# Altium schematic sheet IonValveCtrl.SchDoc
size A
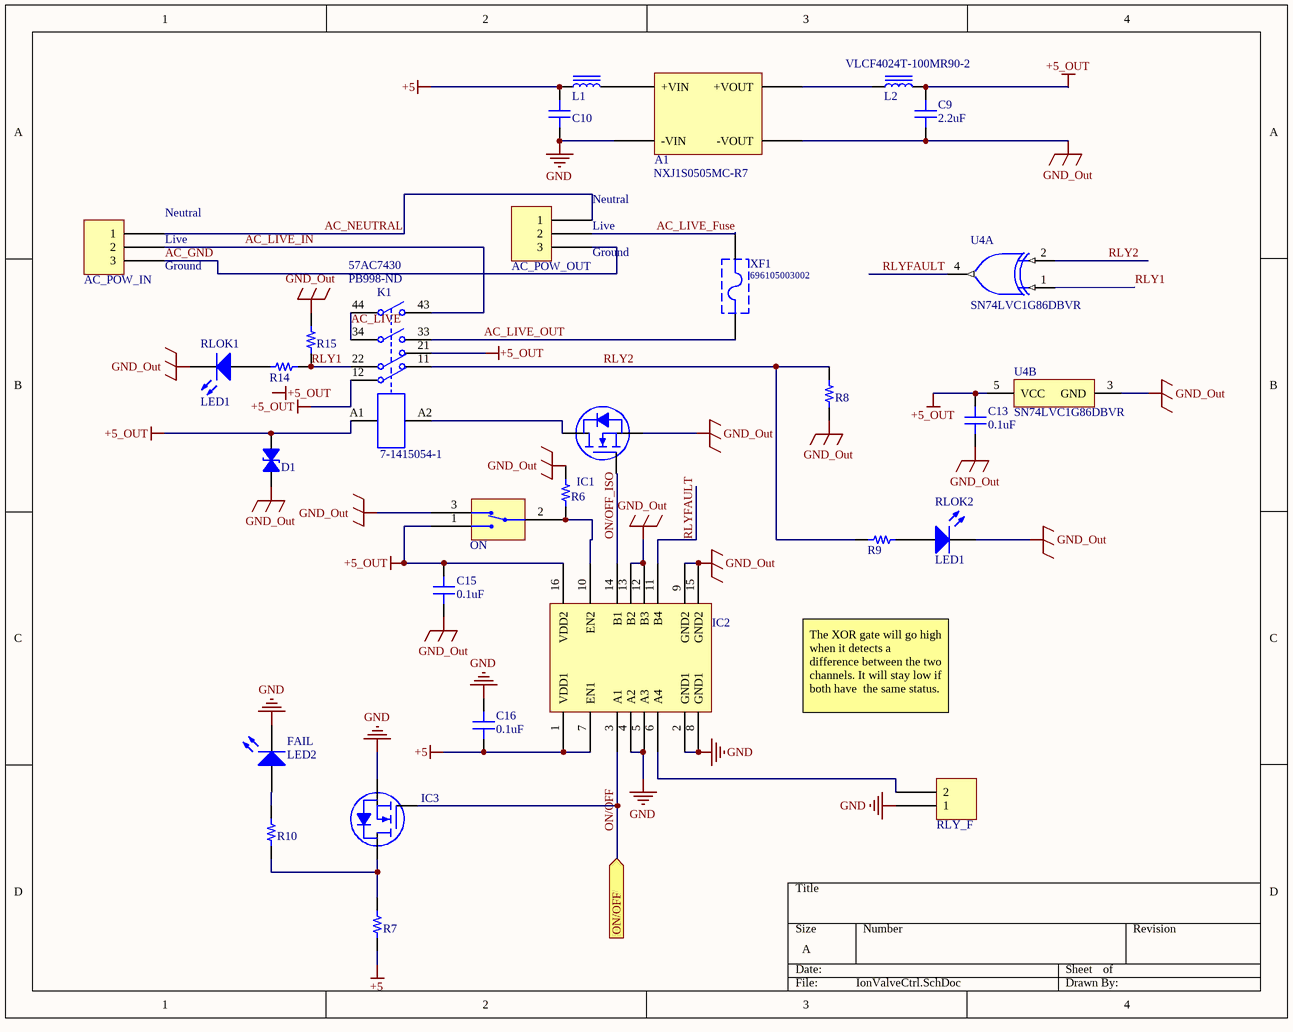
[diagram p0: IonValveCtrl.SchDoc]

## Parts
A1  NXJ1S0505MC-R7  [MURATA NXJ1]
AC_POW_IN  691508110303  [WURTH 691508110303]  (value not drawn)
AC_POW_OUT  691508110303  [WURTH 691508110303]  (value not drawn)
C9  2.2uF  [CAP 1206/3216]
C10  4.7uF  [CAP 1206/3216 - 1.8MM]  (value not drawn)
C13  0.1uF  [CAP 0805/2012]
C15  0.1uF  [CAP 0805/2012]
C16  0.1uF  [CAP 0805/2012]
D1  SM15T15CA  [ST DO214AB SMC]  (value not drawn)
FAIL  LED2  [LED-1]
IC1  BSS138WH6327XTSA1  [INFINEON SOT-323-3]  (value not drawn)
IC2  SI8641BB-B-IS  [SI LABS SOIC-16 WIDE]  (value not drawn)
IC3  BSS138WH6327XTSA1  [INFINEON SOT-323-3]  (value not drawn)
K1  7-1415054-1  Supplier Part Number 1: PB998-ND  Supplier Part Number 2: 57AC7430  [TECO-3-1415055-1-10_V]
L1  VLCF4024T-4R7N1R4-2  [TDK VLCF4024-2]  (value not drawn)
L2  VLCF4024T-100MR90-2  [TDK VLCF4024-2]
ON  CL-SB-12B-01T  [SW_CL-SB-12B-01]  (value not drawn)
R6  10k  [RES 1206/3216]  (value not drawn)
R7  620  [RES 1206/3216]  (value not drawn)
R8  10k  [RES 1206/3216]  (value not drawn)
R9  620  [RES 1206/3216]  (value not drawn)
R10  620  [RES 1206/3216]  (value not drawn)
R14  620  [RES 1206/3216]  (value not drawn)
R15  10k  [RES 1206/3216]  (value not drawn)
RLOK1  LED1  [LED-1]
RLOK2  LED1  [LED-1]
RLY_F  0022272021  [MOLEX KK 0022272021]  (value not drawn)
U4  SN74LVC1G86DBVR  [DBV0005A_L]  (parts A,B of 2)
XF1  696105003002  [696105003002]

## Ports
ON/OFF (in)

## Nets
+5: C10.2 C16.1 IC2.1(VDD1) IC2.7(EN1) L1.1 R7.1
+5_OUT: C9.1 C13.1 C15.1 D1.2 IC2.16(VDD2) K1.12 K1.21 K1.A1 L2.2 ON.1(GND) U4.5(VCC)
GND: A1.1(-VIN) C10.1 C16.2 FAIL.2(K) IC2.2(GND1) IC2.4(A2) IC2.5(A3) IC2.8(GND1) IC3.3(S) RLY_F.1
GND_Out: A1.7(-VOUT) C9.2 C13.2 C15.2 D1.1 IC1.3(S) IC2.9(GND2) IC2.12(B3) IC2.13(B2) IC2.15(GND2) ON.3(GND) R6.1 R8.2 R15.2 RLOK1.2(K) RLOK2.2(K) U4.3(GND)
AC_GND: AC_POW_IN.3 AC_POW_OUT.3
AC_LIVE: K1.34 K1.44
AC_LIVE_Fuse: AC_POW_OUT.2 XF1.2
AC_LIVE_IN: AC_POW_IN.2 K1.43
AC_LIVE_OUT: K1.33 XF1.1
AC_NEUTRAL: AC_POW_IN.1 AC_POW_OUT.1
ON/OFF: IC2.3(A1) IC3.1(G) ; port ON/OFF
ON/OFF_ISO: IC1.1(G) IC2.14(B1)
RLY1: K1.22 R14.2 R15.1 U4.1(A)
RLY2: K1.11 R8.1 R9.1 U4.2(B)
RLYFAULT: IC2.11(B4) U4.4(Y)
NetA1_3: A1.3(+VIN) L1.2
NetA1_8: A1.8(+VOUT) L2.1
NetFAIL_1: FAIL.1(A) R10.2
NetIC1_2: IC1.2(D) K1.A2
NetIC2_6: IC2.6(A4) RLY_F.2
NetIC2_10: IC2.10(EN2) ON.2(GND) R6.2
NetIC3_2: IC3.2(D) R7.2 R10.1
NetR9_2: R9.2 RLOK2.1(A)
NetR14_1: R14.1 RLOK1.1(A)

## Notes on the sheet
- (near AC_POW_IN) Neutral
- Neutral
- (near AC_POW_OUT) Live
- (near AC_POW_IN) Live
- (near AC_POW_IN) Ground
- (near AC_POW_OUT) Ground
- The XOR gate will go high when it detects a difference between the two channels. It will stay low if both have  the same status.
- Labels drawn without touching a wire or pin: +5_OUT

## Library data of the parts
A1 = NXJ1S0505MC-R7: DC/DC SM 1W 5V-5V SINGLE 4.2KV; Manufacturer: Murata Power Solutions Inc.; Number Of Outputs: 1; Voltage - Input (Min): 4.5V; Voltage - Input (Max): 5.5V; Voltage - Output 1: 5V; Current - Output (Max): 200mA; Voltage - Isolation: 4.2kV (4200V); Part Number: NXJ1S0505MC-R7; PartId: 14964; Supplier 1: Digi-Key; Supplier Part Number 1: 811-3094-1-ND; ComponentLink1Description: Datasheet; ComponentLink1URL: http://power.murata.com/data/power/ncl/kdc_nxj1.pdf; ComponentLink2Description: Digi-Key Listing; ComponentLink2URL: https://www.digikey.com/product-detail/en/murata-power-solutions-inc/NXJ1S0505MC-R7/811-3094-1-ND/5697921; Price: 3.55; Type: Isolated Module; Device Package: 14-SMD Module (5 Leads); Operating Temperature: -40C ~ 85C; Power (Watts): 1W
AC_POW_IN AC_POW_OUT = 691508110303: CONN TERM BLK 3POS 3.5MM BLACK; Manufacturer: Wurth Electronics Inc; TemperatureRange: -40C ~ 130C; Voltage: 300V; Pitch: 0.138" (3.50mm); Number Of Levels: 1; Positions Per Level: 3; Part Number: 691508110303; PartId: 16443; Supplier 1: Digi-Key; Supplier Part Number 1: 732-5964-2-ND; ComponentLink1Description: Datasheet; ComponentLink1URL: http://katalog.we-online.de/em/datasheet/6915081103xx.pdf; ComponentLink2Description: Digi-Key Listing; ComponentLink2URL: http://www.digikey.com/product-detail/en/wurth-electronics-inc/691508110303/732-5964-2-ND/5047809; Price: 2.334; Type: Terminal Blocks - Wire to Board; Colour: Black; Orientation: Horizontal and Vertical with Board
C9 = CL31B225KCHSNNE: CAP CER 2.2UF 100V X7R 1206; Manufacturer: Samsung Electro-Mechanics America, Inc.; TemperatureRange: -55C ~ 125C; Tolerance: 10%; Value: 2.2uF; Part Number: CL31B225KCHSNNE; PartId: 6260; Supplier 1: Digi-Key; Supplier Part Number 1: 1276-3138-2-ND; ComponentLink1Description: Datasheet; ComponentLink1URL: http://media.digikey.com/pdf/Data%20Sheets/Samsung%20PDFs/CL31B225KCHSNNE_Spec.pdf; ComponentLink2Description: Digi-Key listing; ComponentLink2URL: http://digikey.com/product-detail/en/CL31B225KCHSNNE/1276-3138-2-ND/3888796; TemperatureCoefficient: X7R; Voltage: 100V; Price: 0.3227; Type: -; Device Package: 1206 (3216 Metric)
C10 = CL31B475KPHNNNE: CAP CER 4.7UF 10V X7R 1206; Manufacturer: Samsung Electro-Mechanics America, Inc.; TemperatureRange: -55C ~ 125C; Tolerance: 10%; Value: 4.7uF; Part Number: CL31B475KPHNNNE; PartId: 17410; Supplier 1: Digi-Key; Supplier Part Number 1: 1276-1133-2-ND; ComponentLink1Description: Datasheet; ComponentLink1URL: http://www.samsungsem.com/kr/front/downloadcms.do?path=/kr/support/product-search/mlcc/__icsFiles/afieldfile/2014/11/05&fileName=C_CL31B475KPHNNNE.pdf; ComponentLink2Description: Digi-Key Listing; ComponentLink2URL: https://www.digikey.com/product-detail/en/samsung-electro-mechanics-america-inc/CL31B475KPHNNNE/1276-1133-2-ND/3886791; TemperatureCoefficient: X7R; Voltage: 10V; Price: 0.0761; Device Package: 1206 (3216 Metric)
C13 C15 C16 = CL21B104KACNNNC: CAP CER 0.1UF 25V X7R 0805; Manufacturer: Samsung Electro-Mechanics America, Inc.; TemperatureRange: -55C ~ 125C; Tolerance: 10%; Value: 0.1uF; Part Number: CL21B104KACNNNC; PartId: 5699; Supplier 1: Digi-Key; Supplier Part Number 1: 1276-1099-2-ND; ComponentLink1Description: Datasheet; ComponentLink1URL: http://www.samsungsem.com/kr/support/product-search/mlcc/CL21B104KACNNNC.jsp; ComponentLink2Description: Digi-Key listing; ComponentLink2URL: http://digikey.com/product-detail/en/CL21B104KACNNNC/1276-1099-2-ND/3886757; TemperatureCoefficient: X7R; Voltage: 25V; Price: 0.0099; Device Package: 0805 (2012 Metric); Type: -
D1 = SM15T15CA: TVS DIODE 12.8VWM 27.2VC SMC; Manufacturer: STMicroelectronics; Type: Zener; Bidirectional Channels: 1; Power - Peak Pulse: 1500W (1.5kW); Current - Peak Pulse: 368A (8/20us); Voltage (Clamping): 27.2V; Voltage (Breakdown): 14.3V; Voltage (Reverse Standoff): 12.8V; Part Number: SM15T15CA; PartId: 14821; Supplier 1: Digi-Key; Supplier Part Number 1: 497-7863-2-ND; ComponentLink1Description: Datasheet; ComponentLink1URL: http://www.st.com/web/en/resource/technical/document/datasheet/CD00000724.pdf; ComponentLink2Description: Digi-Key Listing; ComponentLink2URL: https://www.digikey.com/product-detail/en/stmicroelectronics/SM15T15CA/497-7863-2-ND/1039033; Operating Temperature: -55C ~ 150C (TJ); Price: 0.2798; Device Package: DO-214AB, SMC
FAIL RLOK1 RLOK2 = LED1: Typical RED GaAs LED; Published: 8-Jun-2000; LatestRevisionDate: 08-Jul-2005; LatestRevisionNote: Mech Layer 1 removed.; PackageReference: LED-1; Publisher: Altium Limited; PackageDescription: LED; 2 Leads
IC1 IC3 = BSS138WH6327XTSA1: MOSFET N-CH 60V 280MA SOT-323; Manufacturer: Infineon Technologies; Rds On (Max) at Id, Vgs: 3.5 Ohm @ 200mA, 10V; Vgs(th) (Max) at Id: 1.4V @ 26uA; Gate Charge (Qg): 1.5nC @ 10V; Input Capacitance (Ciss) at Vds: 43pF @ 25V; Power - Max: 500mW; Current Continuous Drain: 280mA (Ta); Part Number: BSS138WH6327XTSA1; PartId: 8084; Supplier 1: Digi-Key; Supplier Part Number 1: BSS138WH6327XTSA1TR-ND; ComponentLink1Description: Datasheet; ComponentLink1URL: http://www.infineon.com/dgdl/Infineon-BSS138W-DS-v02_43-en.pdf?fileId=db3a304335113a6301351e62fcb4131f; ComponentLink2Description: Digi-Key Listing; ComponentLink2URL: http://www.digikey.com/product-detail/en/BSS138WH6327XTSA1/BSS138WH6327XTSA1TR-ND/5410120; Price: 0.0483; Type: MOSFET N-Channel, Metal Oxide; Device Package: SC-70, SOT-323; Drain to Source Voltage (Vdss): 60V; Features: Logic Level Gate
IC2 = Si8641BB-B-IS: DGTL ISO 2.5KV GEN PURP 16SOIC; Manufacturer: Silicon Labs; Isolated Power: No; Number of Channels: 4; Inputs - Side 1/Side2: 3/1; Channel Type: Unidirectional; Voltage - Isolation: 2500Vrms; Common Mode Transient Immunity (Min): 35kV/us; Data Rate: 150Mbps; Propagation Delay tpLH/tpHL (Max): 13ns, 13ns; Pulse Width Distortion (Max): 4.5ns; Rise / Fall Time (Typ): 2.5ns, 2.5ns; Voltage - Supply: 2.5 V ~ 5.5 V; Part Number: SI8641BB-B-IS; PartId: 14408; Supplier 1: Digi-Key; Supplier Part Number 1: SI8641BB-B-IS-ND; ComponentLink1Description: Datasheet; ComponentLink1URL: http://www.silabs.com/Support%20Documents/TechnicalDocs/Si864x.pdf; ComponentLink2Description: Digi-Key Listing; ComponentLink2URL: https://www.digikey.com/product-detail/en/silicon-labs/SI8641BB-B-IS/SI8641BB-B-IS-ND/4576743; Price: 3.81; Type: General Purpose; Device Package: 16-SOIC (0.295", 7.50mm Width); Operating Temperature: -40C ~ 125C; Technology: Capacitive Coupling
K1 = CMP-1684-00019-1: Force Guided Relay SR4 D/M, 5 V, 8 A, -25 to 70 degC, 10-Pin THD, RoHS, Box and Tube; Manufacturer: TE Connectivity; Relay Construction: Non-Latching; Dropout Volt (Min): 2.4VDC; Coil Current: 33.33mA; Product Depth (mm): 13mm; LED Indicator: No; Product Height (mm): 16.5mm; Maximum Power Rating: 2KVA; Voltage Rating (VAC): 400V; Pick-up Voltage (Max): 18VDC; Coil Resistance: 720ohm; Coil Voltage DC: 24V; Product Length (mm): 40mm; Seal: Unsealed; Contact Arrangement: DPST-NO/DPST-NC; Contact Current Rating: 8A; Contact Form: 2FormA/2FormB; Datasheet Version: Rev. 0415; Type: SafetyRelay; Packaging: Tube; Operating Temp Range: -25Cto70C; Package / Case: DustCover; Pin Count: 10; Datasheet URL: http://www.te.com/commerce/DocumentDelivery/DDEController?Action=showdoc&DocId=Data+Sheet%7FSR4_D%2FM%7F0415%7Fpdf%7FEnglish%7FENG_DS_SR4_DXM_0415.pdf%7F3-1415055-1; Mounting Style: ThroughHole; Manufacturer URL: http://www.te.com; Coil Suppression Diode: No; Dropout Volt: 2.4VDC; Rad Hardened: No; Termination Style: PCPin; Package Description: 10-Pin Through Hole device, Body 40 x 13 mm; Package Reference: THD; Push To Test Button: No; Contact Material: AgSnO2; Supplier 1: Digi-Key; Supplier 2: Newark
L1 = VLCF4024T-4R7N1R4-2: FIXED IND 4.7UH 1.43A 87 MOHM; Manufacturer: TDK Corporation; Type: Wirewound; Material - Core: Ferrite; Tolerance: 30%; Shielding: Shielded; DC Resistance (DCR): 87 mOhm Max; Value: 4.7uH; Part Number: VLCF4024T-4R7N1R4-2; PartId: 16432; Supplier 1: Digi-Key; Supplier Part Number 1: 445-8737-2-ND; ComponentLink1Description: Datasheet; ComponentLink1URL: https://product.tdk.com/info/en/catalog/datasheets/inductor_commercial_power_vlcf4024-2_en.pdf; ComponentLink2Description: Digi-Key Listing; ComponentLink2URL: https://www.digikey.com/product-detail/en/tdk-corporation/VLCF4024T-4R7N1R4-2/445-8737-2-ND/3083279; Price: 0.441; Device Package: Nonstandard; Series: VLCF; Inductance: 4.7uH; Current Rating: 1.43A; Current - Saturation: 1.43A; Operating Temperature: -40C ~ 105C
L2 = VLCF4024T-100MR90-2: FIXED IND 10UH 900MA 136 MOHM; Manufacturer: TDK Corporation; Type: Wirewound; Material - Core: Ferrite; Tolerance: 20%; Shielding: Shielded; DC Resistance (DCR): 136 mOhm Max; Value: 10uH; Part Number: VLCF4024T-100MR90-2; PartId: 16429; Supplier 1: Digi-Key; Supplier Part Number 1: 445-8727-2-ND; ComponentLink1Description: Datasheet; ComponentLink1URL: https://product.tdk.com/info/en/catalog/datasheets/inductor_commercial_power_vlcf4024-2_en.pdf; ComponentLink2Description: Digi-Key Listing; ComponentLink2URL: https://www.digikey.com/product-detail/en/tdk-corporation/VLCF4024T-100MR90-2/445-8727-2-ND/3083281; Price: 0.441; Device Package: Nonstandard; Series: VLCF; Inductance: 10uH; Current Rating: 900mA; Current - Saturation: 900mA; Operating Temperature: -40C ~ 105C
ON = CL-SB-12B-01T: SWITCH SLIDE SPDT 200MA 12V; Manufacturer: Nidec Copal Electronics; Switch Function: On-On; Actuator Type: Standard; Switch Travel: 2.00mm; Mechanical Life: 10,000 Cycles; Part Number: CL-SB-12B-01T; PartId: 16472; Supplier 1: Digi-Key; Supplier Part Number 1: 563-1318-1-ND; ComponentLink1Description: Datasheet; ComponentLink1URL: https://www.nidec-copal-electronics.com/e/catalog/switch/cl-sb.pdf; ComponentLink2Description: Digi-Key Listing; ComponentLink2URL: https://www.digikey.com/product-detail/en/nidec-copal-electronics/CL-SB-12B-01T/563-1318-1-ND/3507878; Price: 0.9; TYPE: Slide Switches; Series: CL-SB; Circuit: SPDT; Operating Temperature: -40°C ~ 85°C
R6 R8 R15 = ERJ-8ENF1002V: RES SMD 10K OHM 1% 1/4W 1206; Manufacturer: Panasonic Electronic Components; TemperatureRange: -55C ~ 155C; TemperatureCoefficient: 100ppm/C; PowerRating: 0.25W, 1/4W; Value: 10k; Part Number: ERJ-8ENF1002V; PartId: 2956; Supplier 1: Digi-Key; Supplier Part Number 1: P10.0KFTR-ND; ComponentLink1Description: Datasheet; ComponentLink1URL: http://industrial.panasonic.com/www-cgi/jvcr13pz.cgi?E+PZ+3+AOA0002+ERJ8ENF1002V+7+WW; ComponentLink2Description: Digi-Key listing; ComponentLink2URL: http://digikey.com/product-detail/en/ERJ-8ENF1002V/P10.0KFTR-ND/89059; Tolerance: 1%; Price: 0.0093; Type: Thick Film; Device Package: 1206 (3216 Metric)
R7 R9 R10 R14 = ERJ-8ENF6200V: RES SMD 620 OHM 1% 1/4W 1206; Manufacturer: Panasonic Electronic Components; TemperatureRange: -55C ~ 155C; TemperatureCoefficient: 100ppm/C; PowerRating: 0.25W, 1/4W; Value: 620; Part Number: ERJ-8ENF6200V; PartId: 3356; Supplier 1: Digi-Key; Supplier Part Number 1: P620FTR-ND; ComponentLink1Description: Datasheet; ComponentLink1URL: http://industrial.panasonic.com/www-cgi/jvcr13pz.cgi?E+PZ+3+AOA0002+ERJ8ENF6200V+7+WW; ComponentLink2Description: Digi-Key listing; ComponentLink2URL: http://digikey.com/product-detail/en/ERJ-8ENF6200V/P620FTR-ND/1746078; Tolerance: 1%; Price: 0.0093; Type: Thick Film; Device Package: 1206 (3216 Metric)
RLY_F = 0022272021: CONN HEADER 2POS .100 VERT TIN; Manufacturer: Molex, LLC; Pitch: 0.100" (2.54mm); Number Of Positions: 2; Part Number: 0022272021; PartId: 9719; Supplier 1: Digi-Key; Supplier Part Number 1: WM4111-ND; ComponentLink1Description: Datasheet; ComponentLink1URL: http://www.molex.com/pdm_docs/sd/022272021_sd.pdf; ComponentLink2Description: Digi-Key Listing; ComponentLink2URL: http://www.digikey.com/product-search/en?keywords=22-27-2021; Price: 0.25; Type: Header, Unshrouded; Contact Finish: Tin; Fastening Type: Friction Lock; Number Of Rows: 1; Colour: Natural; Series: KK 6410
U4 = CMP-0859-00174-3: Single 2-Input Exclusive-OR Gate, DBV0005A, LARGE T&R; Manufacturer: Texas Instruments; Schmitt Trigger: No; Output Type: CMOS; Bits(#): 1; Rating: Catalog; Technology Family: LVC; VCC(Max)(V): 5.5; Input Type: CMOS/TTL; F @ Nom Voltage(Max)(Mhz): 150; Voltage(Nom)(V): 1.8,2.5,3.3,5; VCC(Min)(V): 1.65; Output Drive (IOL/IOH)(Max)(mA): 32/-32; ICC @ Nom Voltage(Max)(mA): 0.01; Logic: True; Sub-Family: XOR Gate; Gate Type: XOR; tpd @ Nom Voltage(Max)(ns): 9.9,5.5,5,4; Generic Part Number: SN74LVC1G86; DatasheetVersion: SCES222O; Operating Temperature Range(C): -40 to 125,-40 to 85; 3-State Output: No; PackageReference: DBV0005A
XF1 = CMP-1502-00234-1: WR-FSH Fuse Holder Blocks Fuse Holder Blocks Clip Cover for PCB; Manufacturer: Wurth Elektronik; Fuse Size: 5x20mm; Mounting Technology: THT; Publisher: WurthElektronik; Manufacturer URL: http://www.we-online.de; Package Reference: 696105003002; Part Number: 696105003002; Packaging: Box; Datasheet URL: https://katalog.we-online.de/em/datasheet/696105003002.pdf; Operating Temperature: -30to120degC